# EAGLE design ESP32-S2_v4_dongle (EAGLE 9.5.2)
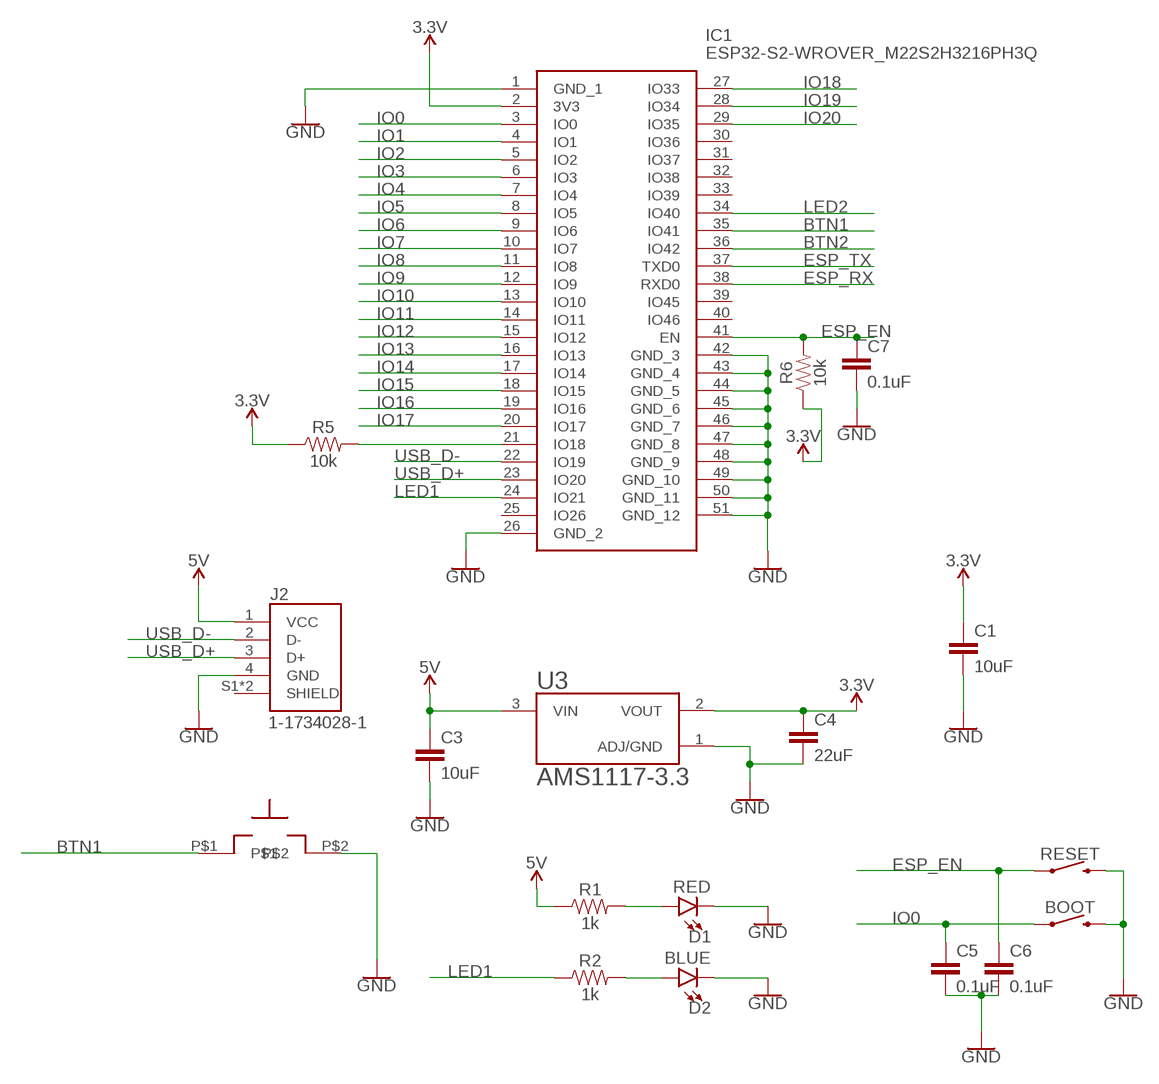
[diagram p0: schematic, sheet 1]

## Parts
BOOT  MOMENTARY-SWITCH-SPST-SMD-4.6X2.8MM  [TACTILE_SWITCH_SMD_4.6X2.8MM]
C1  10uF  10UF-0603-6.3V-20%  [0603]
C3  10uF  10UF-0603-6.3V-20%  [0603]
C4  22uF  10UF-0603-6.3V-20%  [0603]
C5  0.1uF  0.1UF-0603-25V-(+80/-20%)  [0603]
C6  0.1uF  0.1UF-0603-25V-(+80/-20%)  [0603]
C7  0.1uF  0.1UF-0603-25V-(+80/-20%)  [0603]
D1  RED  LED-RED0603  [LED-0603]
D2  BLUE  LED-BLUE0603  [LED-0603]
IC1  ESP32-S2-WROVER_M22S2H3216PH3Q  [ESP32S2WROVERM22S2H3216PH3Q0]
J2  1-1734028-1  [TE_1-1734028-1]
R1  1k  1KOHM-0603-1/10W-1%  [0603]
R2  1k  1KOHM-0603-1/10W-1%  [0603]
R5  10k  1KOHM-0603-1/10W-1%  [0603]
R6  10k  1KOHM-0603-1/10W-1%  [0603]
RESET  MOMENTARY-SWITCH-SPST-SMD-4.6X2.8MM  [TACTILE_SWITCH_SMD_4.6X2.8MM]
U3  AMS1117-3.3  [SOT229P700X180-4N]
U$1  TL9320AF400QG  [TL9320AF400QG]

## Nets
3.3V: C1.1 C4.1 IC1.2(3V3) R5.1 R6.1 U3.2(VOUT)
5V: C3.1 J2.1(VCC) R1.1 U3.3(VIN)
BTN1: IC1.35(IO41) U$1.P$1
BTN2: IC1.36(IO42)
ESP_EN: C6.1 C7.1 IC1.41(EN) R6.2 RESET.1 RESET.2
ESP_RX: IC1.38(RXD0)
ESP_TX: IC1.37(TXD0)
GND: BOOT.3 BOOT.4 C1.2 C3.2 C4.2 C5.2 C6.2 C7.2 D1.C D2.C IC1.1(GND_1) IC1.26(GND_2) IC1.42(GND_3) IC1.43(GND_4) IC1.44(GND_5) IC1.45(GND_6) IC1.46(GND_7) IC1.47(GND_8) IC1.48(GND_9) IC1.49(GND_10) IC1.50(GND_11) IC1.51(GND_12) J2.4(GND) RESET.3 RESET.4 U3.1(ADJ/GND) U$1.P$2
IO0: BOOT.1 BOOT.2 C5.1 IC1.3(IO0)
IO1: IC1.4(IO1)
IO2: IC1.5(IO2)
IO3: IC1.6(IO3)
IO4: IC1.7(IO4)
IO5: IC1.8(IO5)
IO6: IC1.9(IO6)
IO7: IC1.10(IO7)
IO8: IC1.11(IO8)
IO9: IC1.12(IO9)
IO10: IC1.13(IO10)
IO11: IC1.14(IO11)
IO12: IC1.15(IO12)
IO13: IC1.16(IO13)
IO14: IC1.17(IO14)
IO15: IC1.18(IO15)
IO16: IC1.19(IO16)
IO17: IC1.20(IO17)
IO18: IC1.27(IO33)
IO19: IC1.28(IO34)
IO20: IC1.29(IO35)
LED1: IC1.24(IO21) R2.1
LED2: IC1.34(IO40)
N$1: D1.A R1.2
N$2: D2.A R2.2
N$3: IC1.21(IO18) R5.2
USB_D+: IC1.23(IO20) J2.3(D+)
USB_D-: IC1.22(IO19) J2.2(D-)
Unconnected: IC1.25(IO26) IC1.30(IO36) IC1.31(IO37) IC1.32(IO38) IC1.33(IO39) IC1.39(IO45) IC1.40(IO46)

## Power pins joined to a net without a drawn wire
SHIELD: J2.S1(SHIELD) J2.S2(SHIELD)

## Library data of the parts
BOOT RESET = SparkFun-Switches:MOMENTARY-SWITCH-SPST: Momentary Switch (Pushbutton) - SPST Normally-open (NO) SPST momentary switches (buttons, pushbuttons). Variants PTH-12MM - 12mm square, through-hole Momentary Pushbutton Switch - 12mm Square <https://www.sparkfun.com/products/9190> (COM-09190) PTH-6.0MM, PTH-6.0MM-KIT - 6.0mm square, through-hole Mini Pushbutton Switch <https://www.sparkfun.com/products/97> (COM-00097) KIT package intended for soldering kit's - only one side of pads' copper is exposed. PTH-RIGHT-ANGLE-KIT - Right-angle, through-hole Right Angle Tactile Button <https://www.sparkfun.com/products/10791> - Used on SparkFun BigTime Watch Kit <https://www.sparkfun.com/products/11734> SMD-12MM - 12mm square, surface-mount Tactile Button - SMD (12mm) <https://www.sparkfun.com/products/12993> (COM-12993) Used on SparkFun PicoBoard <https://www.sparkfun.com/products/11888> SMD-4.5MM - 4.5mm Square Trackball Switch Used on SparkFun Blackberry Trackballer Breakout <https://www.sparkfun.com/products/13169> SMD-4.6MMX2.8MM - 4.60mm x 2.80mm, surface mount Used on SparkFun SAMD21 Mini Breakout <https://www.sparkfun.com/products/13664> SMD-5.2MM, SMD-5.2-REDUNDANT - 5.2mm square, surface-mount Mini Pushbutton Switch - SMD <https://www.sparkfun.com/products/8720> (COM-08720) Used on Arduino Pro Mini <https://www.sparkfun.com/products/11114> REDUNDANT package connects both switch circuits together SMD-6.0X3.5MM - 6.0 x 3.5mm, surface mount Momentary Reset Switch SMD <https://www.sparkfun.com/products/8229> (COM-08229) SMD-6.2MM-TALL - 6.2mm square, surface mount Tactile Button - SMD (6mm) <https://www.sparkfun.com/products/12992> Used on SparkFun Digital Sandbox <https://www.sparkfun.com/products/12651> SMD-RIGHT-ANGLE - Right-angle, surface mount Used on SparkFun Block for Intel® Edison - Arduino <https://www.sparkfun.com/products/13036>; PROD_ID: SWCH-13065
C1 C3 = SparkFun-Capacitors:10UF: 10.0µF ceramic capacitors A capacitor is a passive two-terminal electrical component used to store electrical energy temporarily in an electric field.; PROD_ID: CAP-11015
C4 = SparkFun-Capacitors:10UF: 10.0µF ceramic capacitors A capacitor is a passive two-terminal electrical component used to store electrical energy temporarily in an electric field.; PROD_ID: CAP-11015; VALUE: 10uF
C5-C7 = SparkFun-Capacitors:0.1UF: 0.1µF ceramic capacitors A capacitor is a passive two-terminal electrical component used to store electrical energy temporarily in an electric field.; PROD_ID: CAP-00810
D1 = SparkFun-LED:LED-RED: Red SMD LED Used in manufacturing of most products at SparkFun Packages: 0603 - SMD 0603 package [Product Link] <http://docs.avagotech.com/docs/AV02-0551EN> 0603 SMART - SMD 0603 SMART package ( more efficient and expensive)[Product Link] <http://www.osram-os.com/Graphics/XPic2/00077099_0.pdf> 1206 - SMD1206 package [Product Link] <https://www.sparkfun.com/datasheets/DevTools/LilyPad/Q150OVS4.pdff> SparkFun Products: Pro Mini 328 -5V <https://www.sparkfun.com/products/821> RedBoard <https://www.sparkfun.com/products/12757> IOIO-OTG <https://www.sparkfun.com/products/13613>; PROD_ID: DIO-00819
D2 = SparkFun-LED:LED-BLUE: Blue SMD LED Used in manufacturing of various products at SparkFun Packages: 0603 - SMD 0603 package [Product Link] <http://www.digikey.com/product-detail/en/SMLE12BC7TT86/511-1589-2-ND/1641808> 1206 - SMD1206 package [Product Link] <http://www.digikey.com/product-detail/en/lite-on-inc/LTST-C150TBKT/160-1643-1-ND/573584> SparkFun Products: ESP8266 Thing-Dev Board <https://www.sparkfun.com/products/13711> RedBoard <https://www.sparkfun.com/products/12757>; PROD_ID: DIO-08575
IC1 = SamacSys_Parts:ESP32-S2-WROVER_M22S2H3216PH3Q: WiFi Modules (802.11) Module ESP32-S2 WROVER PCB ANT Source: Datasheet <https://www.espressif.com/sites/default/files/documentation/esp32-s2-wrover_esp32-s2-wrover-i_datasheet_en.pdf>; DESCRIPTION: WiFi Modules (802.11) Module ESP32-S2 WROVER PCB ANT; HEIGHT: 3.45mm; MANUFACTURER_NAME: Espressif Systems; MANUFACTURER_PART_NUMBER: ESP32-S2-WROVER(M22S2H3216PH3Q0); MOUSER_PART_NUMBER: 356-ESP32S2WRV3216PH; MOUSER_PRICE-STOCK: https://www.mouser.co.uk/ProductDetail/Espressif-Systems/ESP32-S2-WROVERM22S2H3216PH3Q0?qs=vHuUswq2%252BswhBPbltcIS8Q%3D%3D
J2 = 1-1734028-1:1-1734028-1: Conn USB 2.0 Type A PL 4 POS Solder RA SMD 4 Terminal 1 Port T/R Check prices <https://pricing.snapeda.com/parts/1-1734028-1/TE%20Connectivity/view-part?ref=eda>; AVAILABILITY: In Stock; CENTERLINE_PITCH: 2 mm[.078 in]; COMMENT: 1-1734028-1; DESCRIPTION: Conn USB 2.0 Type A PL 4 POS Solder RA SMD 4 Terminal 1 Port T/R; MF: TE Connectivity; MP: 1-1734028-1; NUMBER_OF_POSITIONS: 4; PACKAGE: None; PRICE: None; PRODUCT_TYPE: Connector; PURCHASE-URL: https://pricing.snapeda.com/search/part/1-1734028-1/?ref=eda
R1 R2 = SparkFun-Resistors:1KOHM: 1kΩ resistor A resistor is a passive two-terminal electrical component that implements electrical resistance as a circuit element. Resistors act to reduce current flow, and, at the same time, act to lower voltage levels within circuits. - Wikipedia; PROD_ID: RES-07856
R5 R6 = SparkFun-Resistors:1KOHM: 1kΩ resistor A resistor is a passive two-terminal electrical component that implements electrical resistance as a circuit element. Resistors act to reduce current flow, and, at the same time, act to lower voltage levels within circuits. - Wikipedia; PROD_ID: RES-07856; VALUE: 1k
U3 = AMS1117-3.3:AMS1117-3.3: Sot223/Pkg 1-Amp 3.3-Volt Low Drop Out Voltage Regulatator Check prices <https://pricing.snapeda.com/parts/AMS1117-3.3/AMD/view-part?ref=eda>; AVAILABILITY: In Stock; DESCRIPTION: LDO Voltage Regulators 800MA LDO LINEAR REG; MF: AMD; MP: AMS1117-3.3; PACKAGE: None; PRICE: None
U$1 = TL9320AF400QG:TL9320AF400QG

## Board
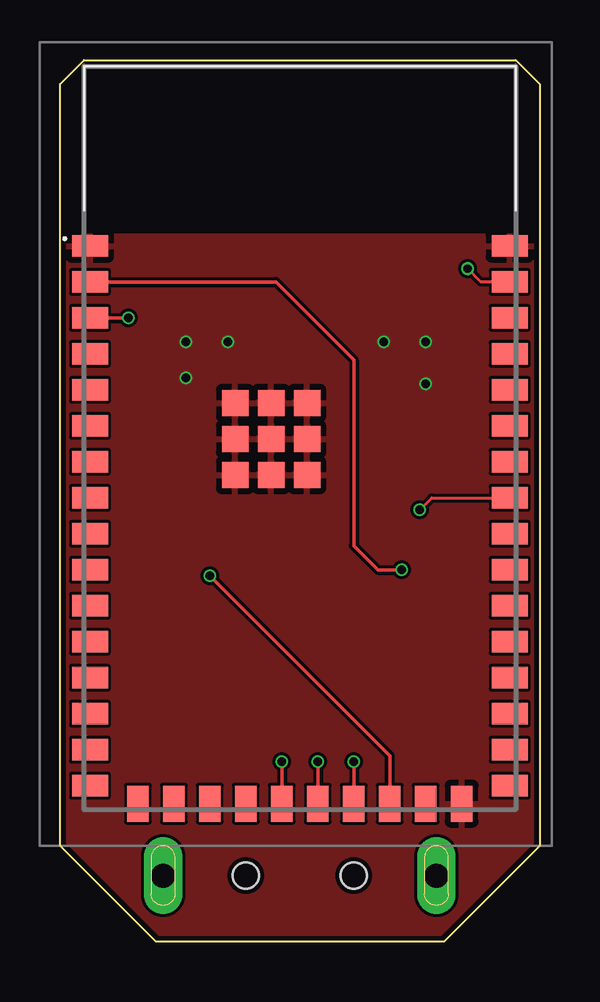
[diagram p1: board, top side]
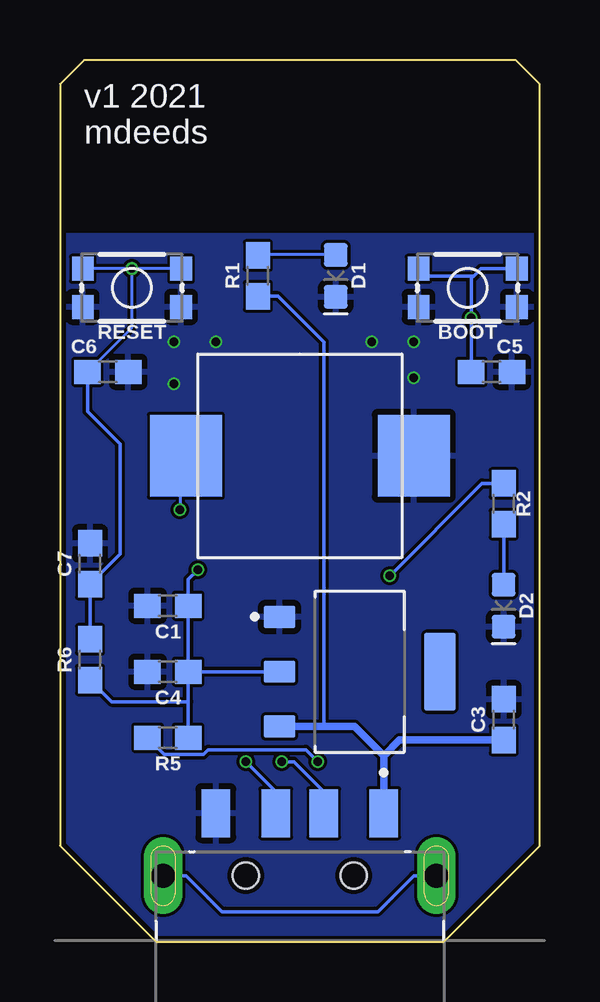
[diagram p2: board, bottom side, seen from below]

Size 20 x 36.75 mm. Coordinates in mm from the lower left corner, seen from the top.
Outline: 0,4 0,35.75 1,36.75 19,36.75 20,35.75 20,4 16,0 4,0 0,4
Copper layers (1*16): Top 0.035559375mm / dielectric 1.6mm / Bottom 0.035559375mm
Design rules "jlcpcb2layer": minimum track width 5mil, minimum drill 12mil, track to track 5mil, track to pad 5mil, pad to pad 5mil, via to via 5mil, smd to smd 5mil, copper to edge 8mil, drill to drill 6mil, minimum pad ring 5mil, minimum via ring 3mil, stop-mask expansion 2.5mil, vias tented up to drill 0mil, thermal gap 10mil

### Footprints (pad centres in the part's own frame; a part is rotated, then mirrored left to right if it is on the bottom)
TACTILE_SWITCH_SMD_4.6X2.8MM = smd 0.9 x 1: 1 -2.05,-0.8; 2 2.05,-0.8; 3 2.05,0.8; 4 -2.05,0.8
0603 = smd 1.1 x 1: 1 -0.85,0; 2 0.85,0
LED-0603 = smd 1 x 1: A -0.877,0; C 0.877,0
ESP32S2WROVERM22S2H3216PH3Q0 = smd 1.5 x 0.9: 1 0,22.5; 2 0,21; 3 0,19.5; 4 0,18; 5 0,16.5; 6 0,15; 7 0,13.5; 8 0,12; 9 0,10.5; 10 0,9; 11 0,7.5; 12 0,6; 13 0,4.5; 14 0,3; 15 0,1.5; 16 0,0; 27 17.5,0; 28 17.5,1.5; 29 17.5,3; 30 17.5,4.5; 31 17.5,6; 32 17.5,7.5; 33 17.5,9; 34 17.5,10.5; 35 17.5,12; 36 17.5,13.5; 37 17.5,15; 38 17.5,16.5; 39 17.5,18; 40 17.5,19.5; 41 17.5,21; 42 17.5,22.5 | smd 0.9 x 1.5: 17 2,-0.75; 18 3.5,-0.75; 19 5,-0.75; 20 6.5,-0.75; 21 8,-0.75; 22 9.5,-0.75; 23 11,-0.75; 24 12.5,-0.75; 25 14,-0.75; 26 15.5,-0.75 | smd 1.1 x 1.1: 43 7.56,14.45; 44 9.06,14.45; 45 9.06,15.95; 46 7.56,15.95; 47 6.06,15.95; 48 6.06,14.45; 49 6.06,12.95; 50 7.56,12.95; 51 9.06,12.95
TE_1-1734028-1 = smd 1.2 x 2: 1 3.5,2.6; 2 1,2.6; 3 -1,2.6; 4 -3.5,2.6 | drill 1 pad 1.6 long: S1 -5.7,0; S2 5.7,0 | hole 1.1: -2.25,0; 2.25,0
SOT229P700X180-4N = smd 0.93 x 1.31: 1 -2.29,-3.345; 2 0,-3.345; 3 2.29,-3.345 | smd 3.24 x 1.31: 4 0,3.345
TL9320AF400QG = smd 3 x 3.4: P$1 -4.75,0; P$2 4.75,0

### Placement (x,y rotation side)
BOOT  3,27.25 180 bottom
C1  15.5,14 180 bottom
C3  1.5,9.25 90 bottom
C4  15.5,11.25 180 bottom
C5  2,23.75 0 bottom
C6  18,23.75 0 bottom
C7  18.75,15.75 90 bottom
D1  8.5,27.75 270 bottom
D2  1.5,14 270 bottom
IC1  1.25,6.5 0 top
J2  10,2.75 0 bottom
R1  11.75,27.75 90 bottom
R2  1.5,18.25 270 bottom
R5  15.5,8.5 180 bottom
R6  18.75,11.75 90 bottom
RESET  17,27.25 180 bottom
U3  7.5,11.25 270 bottom
U$1  10,20.25 0 bottom

### Tracks (layer width: path | path; a pad name or v marks a point on that pad's centre or on a via)
3.3V  (via drill 0.35)
  Top 0.152: IC1.2 9,27.5 12.25,24.25 12.25,16.5 13.25,15.5 v14.25,15.5
  Bottom 0.152: U3.2 14.5,11.25 | 14.5,11.25 C4.1 C1.1 14.65,15.1 v14.25,15.5 | R5.1 14.65,10 | 14.65,10 14.65,11.1 14.5,11.25 | R6.1 17.85,10 14.65,10
5V
  Bottom 0.152: 9,8.96 9,25 10.9,26.9 R1.1
  Bottom 0.305: J2.1 6.5,7.75 | U3.3 9,8.96 7.71,8.96 6.5,7.75 | C3.1 5.85,8.4 6.5,7.75
BTN1  (via drill 0.35)
  Top 0.127: v15,18 15.5,18.5 IC1.35
  Bottom 0.127: U$1.P$1 15,20 v15,18
ESP_EN  (via drill 0.35)
  Top 0.127: IC1.41 17.55,27.5 v17,28.05
  Bottom 0.127: RESET.1 v17,28.05 | v17,28.05 RESET.2 | C6.1 17,25.6 v17,28.05
  Bottom 0.152: R6.2 C7.1 17.5,16.15 17.5,20.75 18.85,22.1 C6.1
GND  (via drill 0.35)
  other vias: 5.25,23.5 5.25,25 7,25 13.5,25 15.25,25 15.25,23.25
  pour Top: -1,29.5 20.75,29.5 20.75,3.25 15.75,-1.75 4,-1.75 -1,3.25
  pour Bottom: -1.5,29.5 21.25,29.5 21.25,3 15.75,-2.5 4,-2.5 -1.5,3
IO0  (via drill 0.35)
  Top 0.152: IC1.3 v2.85,26
  Bottom 0.152: C5.1 v2.85,26 2.85,27.65 2.75,27.75 | BOOT.1 2.45,28.05 2.75,27.75 | BOOT.2 4.75,27.75 2.75,27.75
LED1  (via drill 0.35)
  Top 0.152: IC1.24 13.75,7.75 v6.25,15.25
  Bottom 0.152: v6.25,15.25 2.4,19.1 R2.1
N$1
  Bottom 0.127: D1.A 11.72,28.63 R1.2
N$2
  Bottom 0.152: D2.A R2.2
N$3  (via drill 0.35)
  Top 0.152: v9.25,7.5 IC1.21
  Bottom 0.152: R5.2 15.65,7.8 14.02,7.8 13.81,8 9.75,8 v9.25,7.5
SHIELD
  Bottom 0.152: J2.S2 5.25,2.75 6.75,1.25 13.25,1.25 14.75,2.75 J2.S1
USB_D+  (via drill 0.35)
  Top 0.152: v12.25,7.5 IC1.23
  Bottom 0.152: J2.3 11,6.25 v12.25,7.5
USB_D-  (via drill 0.35)
  Top 0.152: v10.75,7.5 IC1.22
  Bottom 0.152: J2.2 9,6.25 10.25,7.5 v10.75,7.5

### Text on the board
bPlace: v1 2021 | mdeeds